# EAGLE design JonesHBridge (EAGLE 6.4)
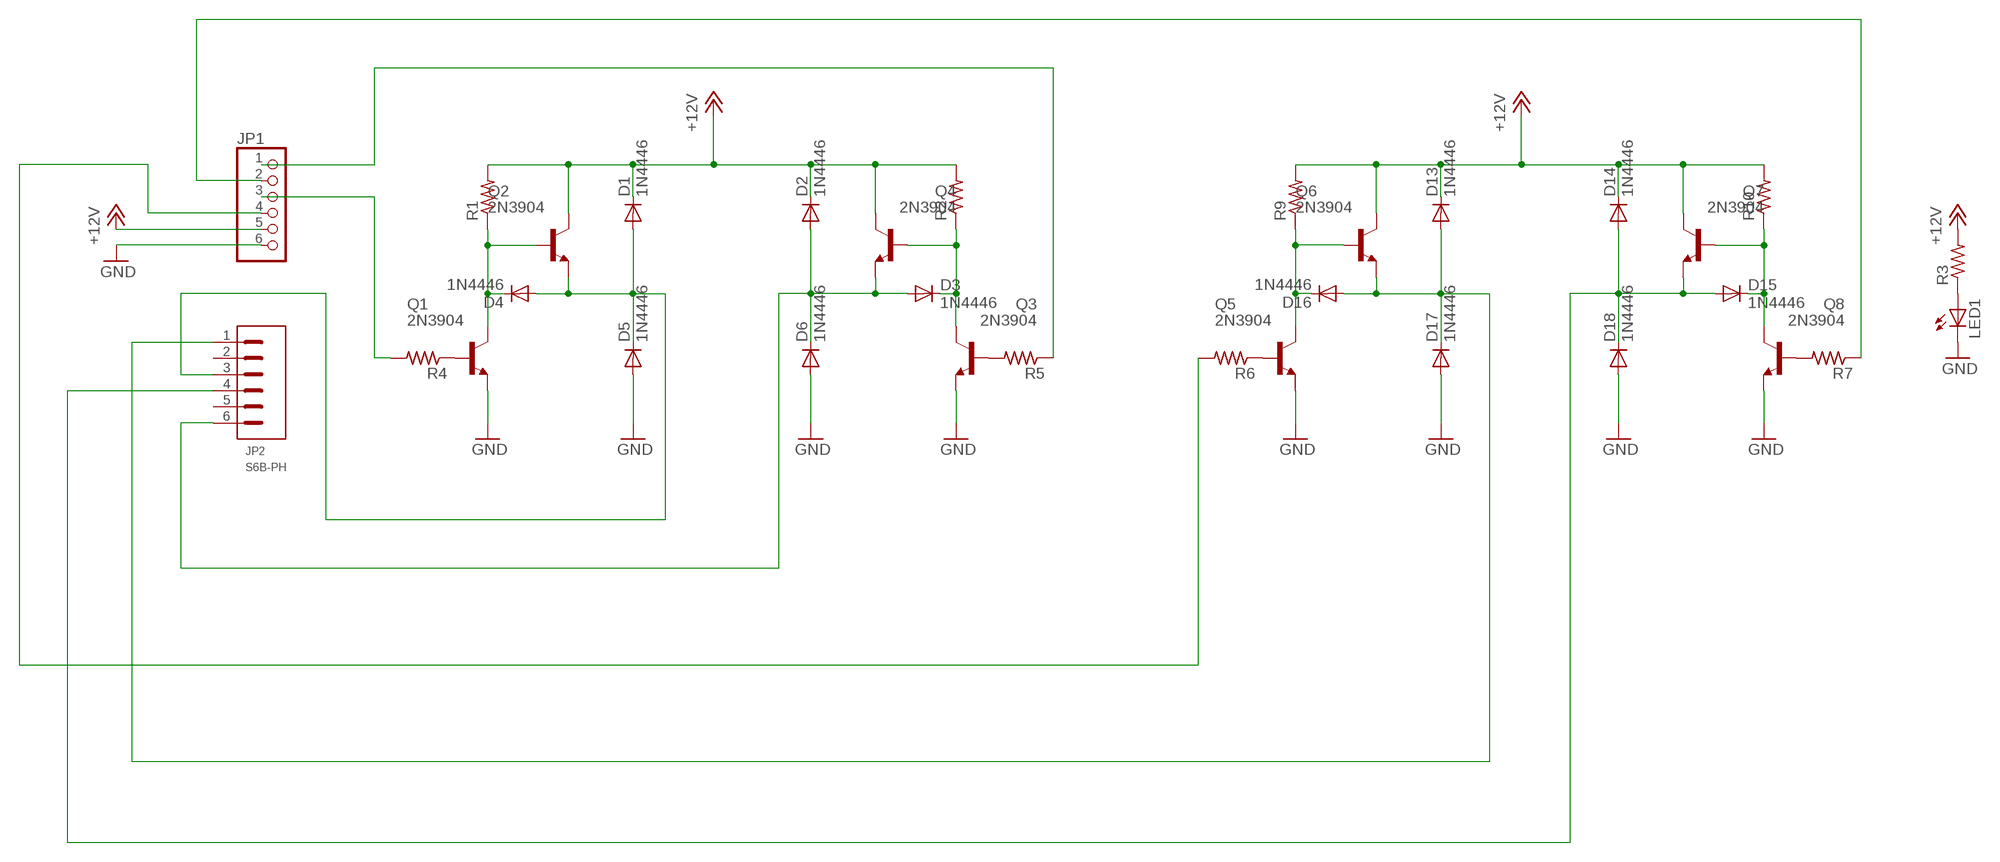
[diagram p0: schematic, sheet 1]

## Parts
D1  1N4446  [DO35-10]
D2  1N4446  [DO35-10]
D3  1N4446  [DO35-10]
D4  1N4446  [DO35-10]
D5  1N4446  [DO35-10]
D6  1N4446  [DO35-10]
D13  1N4446  [DO35-10]
D14  1N4446  [DO35-10]
D15  1N4446  [DO35-10]
D16  1N4446  [DO35-10]
D17  1N4446  [DO35-10]
D18  1N4446  [DO35-10]
JP1  PINHD-1X6  [1X06]
JP2  S6B-PH  [S6B]
LED1  LED3MM  [LED3MM]
Q1  2N3904  [TO92]
Q2  2N3904  [TO92]
Q3  2N3904  [TO92]
Q4  2N3904  [TO92]
Q5  2N3904  [TO92]
Q6  2N3904  [TO92]
Q7  2N3904  [TO92]
Q8  2N3904  [TO92]
R1  R-US_R0805  [R0805]
R2  R-US_R0805  [R0805]
R3  R-US_R0805  [R0805]
R4  R-US_R0805  [R0805]
R5  R-US_R0805  [R0805]
R6  R-US_R0805  [R0805]
R7  R-US_R0805  [R0805]
R9  R-US_R0805  [R0805]
R10  R-US_R0805  [R0805]

## Nets
+12V: D1.C D2.C D13.C D14.C JP1.5 Q2.1(C) Q4.1(C) Q6.1(C) Q7.1(C) R1.2 R2.2 R3.2 R9.2 R10.2
GND: D5.A D6.A D17.A D18.A JP1.6 LED1.K(C) Q1.3(E) Q3.3(E) Q5.3(E) Q8.3(E)
N$1: D4.C Q1.1(C) Q2.2(B) R1.1
N$2: D1.A D4.A D5.C JP2.3 Q2.3(E)
N$3: Q1.2(B) R4.1
N$4: LED1.A R3.1
N$5: Q5.2(B) R6.1
N$6: Q3.2(B) R5.2
N$7: D2.A D3.A D6.C JP2.6 Q4.3(E)
N$8: D3.C Q3.1(C) Q4.2(B) R2.1
N$9: Q8.2(B) R7.2
N$13: D16.C Q5.1(C) Q6.2(B) R9.1
N$14: D15.C Q7.2(B) Q8.1(C) R10.1
N$15: D14.A D15.A D18.C JP2.4 Q7.3(E)
N$16: D13.A D16.A D17.C JP2.1 Q6.3(E)
N$17: JP1.3 R4.2
N$18: JP1.1 R5.1
N$19: JP1.2 R7.1
N$20: JP1.4 R6.2
Unconnected: JP2.2 JP2.5

## Library data of the parts
D1-D6 D13-D18 = diode:1N4446: DIODE high speed (Philips)
JP1 = pinhead:PINHD-1X6: PIN HEADER
JP2 = !!dpkoch:S6B-PH
LED1 = led:LED: LED OSRAM: - CHIPLED LG R971, LG N971, LY N971, LG Q971, LY Q971, LO R971, LY R971 LH N974, LH R974 LS Q976, LO Q976, LY Q976 LO Q996 - Hyper CHIPLED LW Q18S LB Q993, LB Q99A, LB R99A - SideLED LS A670, LO A670, LY A670, LG A670, LP A670 LB A673, LV A673, LT A673, LW A673 LH A674 LY A675 LS A676, LA A676, LO A676, LY A676, LW A676 LS A679, LY A679, LG A679 - Hyper Micro SIDELED® LS Y876, LA Y876, LO Y876, LY Y876 LT Y87S - SmartLED LW L88C, LW L88S LB L89C, LB L89S, LG L890 LS L89K, LO L89K, LY L89K LS L896, LA L896, LO L896, LY L896 - TOPLED LS T670, LO T670, LY T670, LG T670, LP T670 LSG T670, LSP T670, LSY T670, LOP T670, LYG T670 LG T671, LOG T671, LSG T671 LB T673, LV T673, LT T673, LW T673 LH T674 LS T676, LA T676, LO T676, LY T676, LB T676, LH T676, LSB T676, LW T676 LB T67C, LV T67C, LT T67C, LS T67K, LO T67K, LY T67K, LW E67C LS E67B, LA E67B, LO E67B, LY E67B, LB E67C, LV E67C, LT E67C LW T67C LS T679, LY T679, LG T679 LS T770, LO T770, LY T770, LG T770, LP T770 LB T773, LV T773, LT T773, LW T773 LH T774 LS E675, LA E675, LY E675, LS T675 LS T776, LA T776, LO T776, LY T776, LB T776 LHGB T686 LT T68C, LB T68C - Hyper Mini TOPLED® LB M676 - Mini TOPLED Santana® LG M470 LS M47K, LO M47K, LY M47K Source: http://www.osram.convergy.de LUXEON: - LUMILED® LXK2-PW12-R00, LXK2-PW12-S00, LXK2-PW14-U00, LXK2-PW14-V00 LXK2-PM12-R00, LXK2-PM12-S00, LXK2-PM14-U00 LXK2-PE12-Q00, LXK2-PE12-R00, LXK2-PE12-S00, LXK2-PE14-T00, LXK2-PE14-U00 LXK2-PB12-K00, LXK2-PB12-L00, LXK2-PB12-M00, LXK2-PB14-N00, LXK2-PB14-P00, LXK2-PB14-Q00 LXK2-PR12-L00, LXK2-PR12-M00, LXK2-PR14-Q00, LXK2-PR14-R00 LXK2-PD12-Q00, LXK2-PD12-R00, LXK2-PD12-S00 LXK2-PH12-R00, LXK2-PH12-S00 LXK2-PL12-P00, LXK2-PL12-Q00, LXK2-PL12-R00 Source: www.luxeon.com KINGBRIGHT: KA-3528ASYC Source: www.kingbright.com
Q1-Q8 = transistor-npn:2N3904: NPN Transistor
R1-R7 R9 R10 = resistor:R-US_: RESISTOR, American symbol

## Board
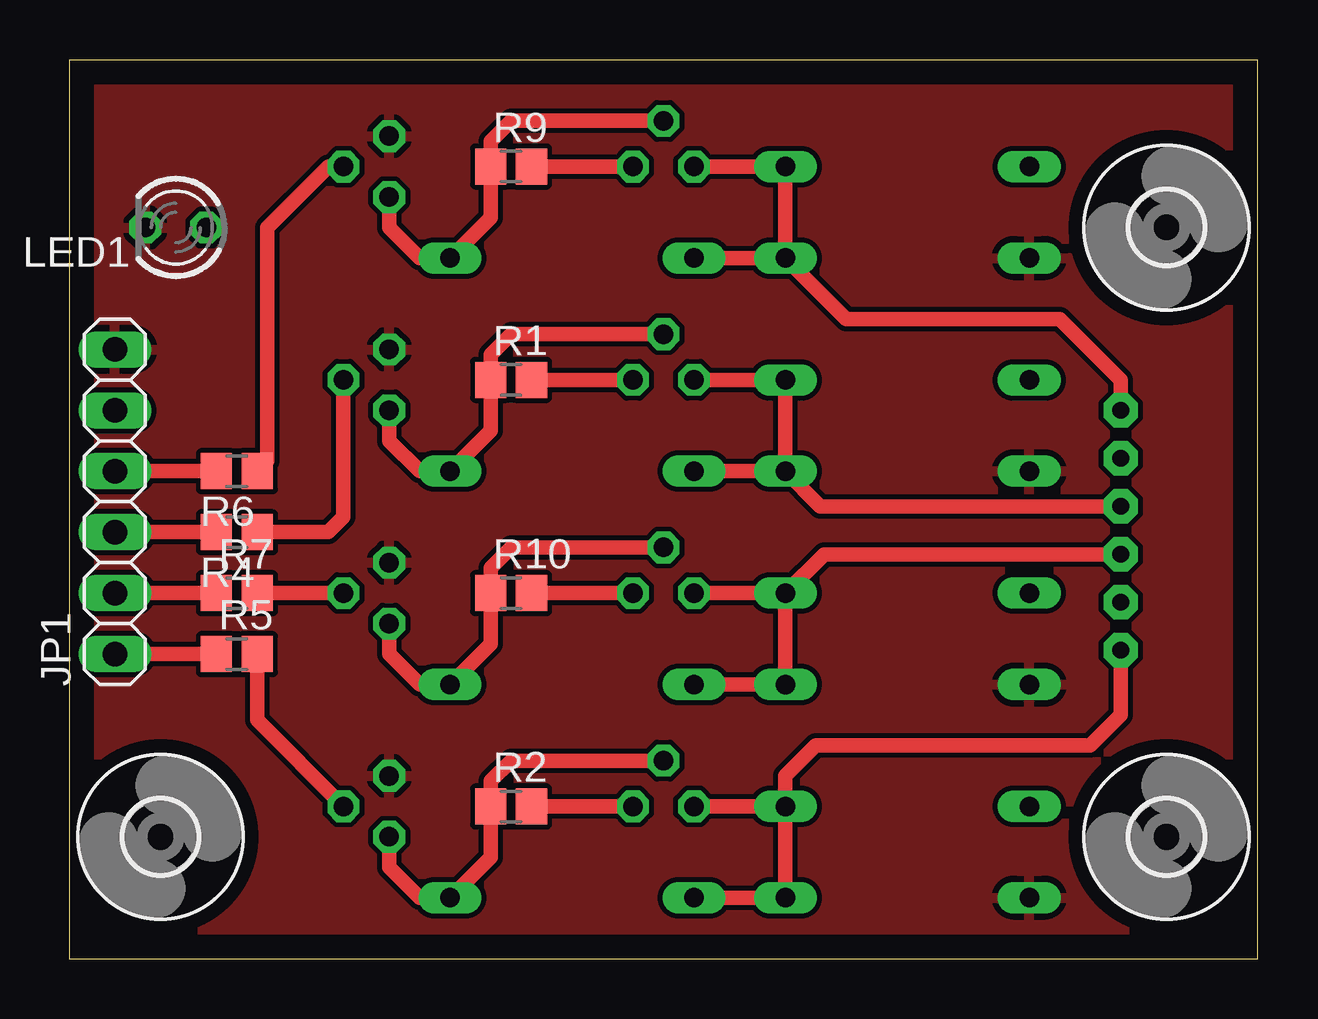
[diagram p1: board, top side]
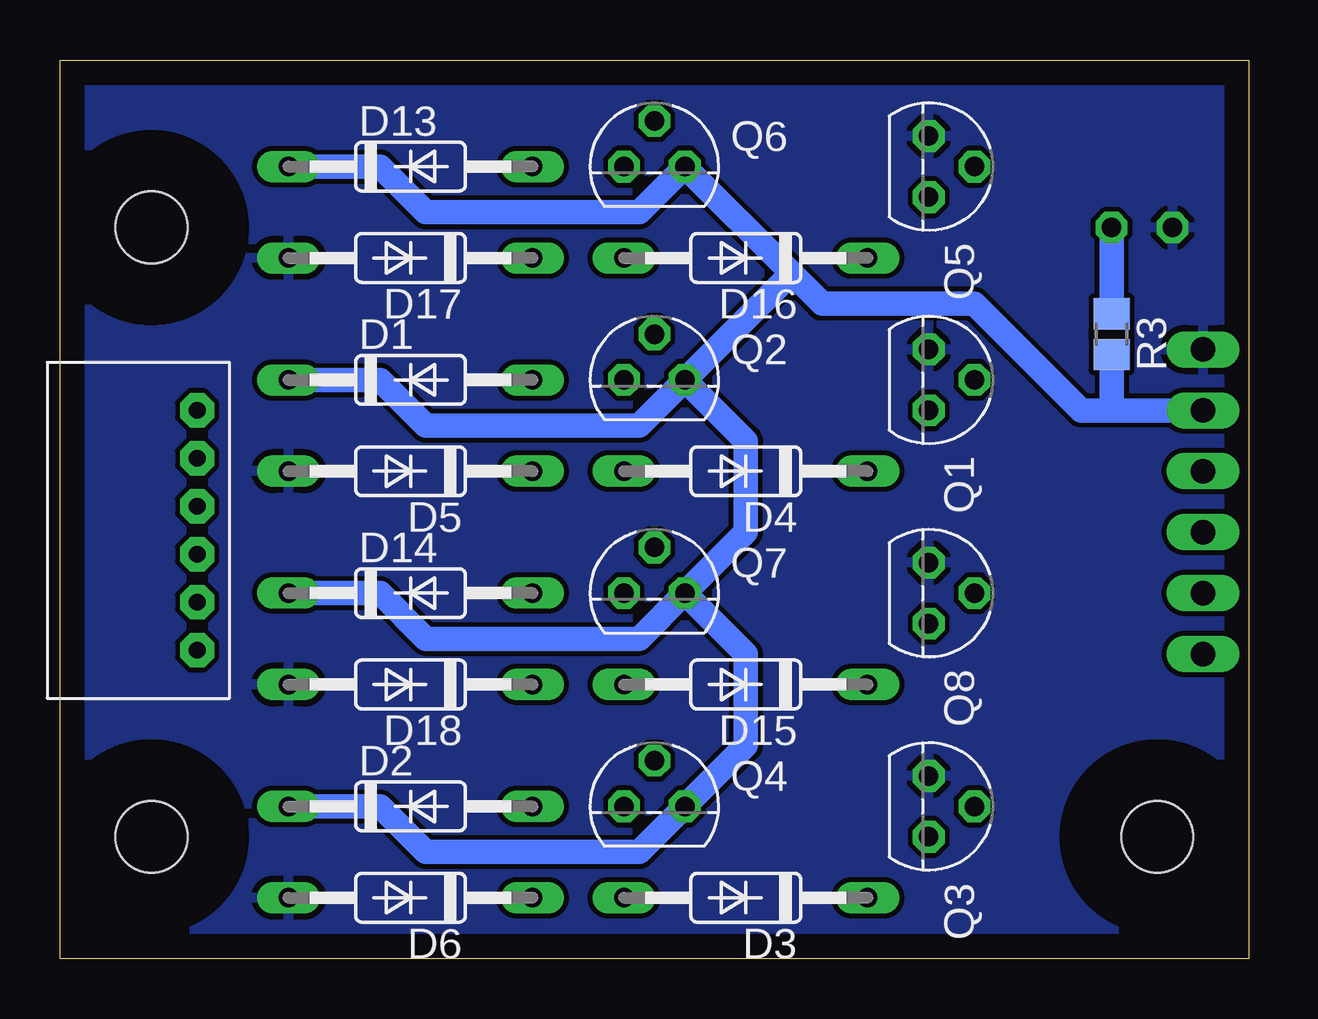
[diagram p2: board, bottom side, seen from below]

Size 49.53 x 37.47 mm. Coordinates in mm from the lower left corner, seen from the top.
Outline: 0,0 49.53,0 49.53,37.47 0,37.47 0,0
Copper layers (1*16): Top 0.035mm / dielectric 1.5mm / Bottom 0.035mm
Design rules "default": minimum track width 10mil, minimum drill 24mil, track to track 8mil, track to pad 8mil, pad to pad 8mil, via to via 8mil, smd to smd 8mil, copper to edge 40mil, drill to drill 8mil, minimum pad ring 10mil, minimum via ring 8mil, stop-mask expansion 4mil, vias tented up to drill 0mil, thermal gap 10mil

### Footprints (pad centres in the part's own frame; a part is rotated, then mirrored left to right if it is on the bottom)
DO35-10 = drill 0.813 long: A 5.08,0; C -5.08,0
1X06 = drill 1.016 long: 1 -6.35,0; 2 -3.81,0; 3 -1.27,0; 4 1.27,0; 5 3.81,0; 6 6.35,0
S6B = drill 0.7 pad 1.422 octagon: 1 0,0; 2 2,0; 3 4,0; 4 6,0; 5 8,0; 6 10,0
LED3MM = drill 0.813 octagon: A -1.27,0; K 1.27,0
TO92 = drill 0.813 octagon: 1 1.27,0; 2 0,1.905; 3 -1.27,0
R0805 = smd 1.3 x 1.5: 1 -0.85,0; 2 0.85,0
3,0 = hole 3: 0,0

### Placement (x,y rotation side)
D1  34.92,24.13 0 bottom
D2  34.92,6.35 0 bottom
D3  20.96,2.54 180 bottom
D4  20.96,20.32 180 bottom
D5  34.92,20.32 180 bottom
D6  34.92,2.54 180 bottom
D13  34.92,33.02 0 bottom
D14  34.92,15.24 0 bottom
D15  20.96,11.43 180 bottom
D16  20.96,29.21 180 bottom
D17  34.92,29.21 180 bottom
D18  34.92,11.43 180 bottom
JP1  1.9,19.05 90 top
JP2  43.81,22.86 270 bottom
LED1  4.45,30.48 180 top
Q1  13.34,24.13 270 bottom
Q2  24.77,24.13 0 bottom
Q3  13.34,6.35 270 bottom
Q4  24.77,6.35 0 bottom
Q5  13.34,33.02 270 bottom
Q6  24.77,33.02 0 bottom
Q7  24.77,15.24 0 bottom
Q8  13.34,15.24 270 bottom
R1  18.41,24.13 0 top
R2  18.41,6.35 0 top
R3  5.71,26.04 270 bottom
R4  6.99,17.78 180 top
R5  6.99,12.7 0 top
R6  6.99,20.32 180 top
R7  6.99,15.24 0 top
R9  18.41,33.02 0 top
R10  18.41,15.24 0 top
U$1  [3,0]  3.81,5.08 0 top
U$2  [3,0]  45.72,5.08 0 top
U$3  [3,0]  45.72,30.48 0 top

### Tracks (layer width: path | path; a pad name or v marks a point on that pad's centre or on a via)
+12V
  Top 0.61: R2.2 Q4.1 | R10.2 Q7.1 | R1.2 Q2.1 | Q6.1 R9.2
  Bottom 1.016: 19.05,28.57 17.78,27.3 11.43,27.3 6.99,22.86 5.71,22.86 | 19.05,28.57 Q6.1 25.4,31.11 34.29,31.11 36.2,33.02 D13.C | Q2.1 19.05,28.57 | Q7.1 20.96,17.78 20.96,21.59 Q2.1 | Q7.1 20.96,12.7 20.96,8.89 Q4.1 25.4,4.45 34.29,4.45 36.2,6.35 D2.C | D14.C 36.2,15.24 34.29,13.34 25.4,13.34 Q7.1 | D1.C 36.2,24.13 34.29,22.23 25.4,22.23 Q2.1 | JP1.5 5.71,22.86 | R3.2 5.71,22.86
GND
  pour Top: -2.54,157.48 -3.81,157.48 -3.81,-5.08 220.98,-5.08 220.98,157.48
  pour Bottom: -2.54,157.48 -6.35,157.48 -6.35,-7.62 231.14,-7.62 231.14,157.48
N$1
  Top 0.61: Q2.2 18.41,26.04 17.57,25.18 R1.1 17.57,22.01 D4.C 14.61,20.32 13.34,21.59 Q1.1
N$2
  Top 0.61: Q2.3 D1.A D5.C | D5.C D4.A | JP2.3 31.31,18.86 D5.C
N$3
  Top 0.61: Q1.2 11.43,18.41 10.79,17.78 R4.1
N$4
  Bottom 1.016: R3.1 LED1.A
N$5
  Top 0.61: Q5.2 10.79,33.02 8.26,30.48 8.26,20.74 R6.1
N$6
  Top 0.61: R5.2 7.84,9.95 Q3.2
N$7
  Top 0.61: Q4.3 D2.A | D2.A D6.C D3.A | D2.A 29.84,7.62 31.11,8.89 42.54,8.89 43.81,10.16 JP2.6
N$8
  Top 0.61: Q4.2 18.41,8.26 17.57,7.41 R2.1 17.57,4.23 D3.C 14.61,2.54 13.34,3.81 Q3.1
N$9
  Top 0.61: Q8.2 R7.2
N$13
  Top 0.61: Q6.2 18.41,34.92 17.57,34.08 R9.1 17.57,30.9 D16.C 14.61,29.21 13.34,30.48 Q5.1
N$14
  Top 0.61: Q7.2 18.41,17.14 17.57,16.3 R10.1 17.57,13.12 D15.C 14.61,11.43 13.34,12.7 Q8.1
N$15
  Top 0.61: D15.A D18.C D14.A | D14.A Q7.3 | JP2.4 31.46,16.86 D14.A
N$16
  Top 0.61: Q6.3 D13.A D17.C | D17.C D16.A | JP2.1 43.81,24.13 41.27,26.67 32.38,26.67 D17.C
N$17
  Top 0.61: JP1.3 R4.2
N$18
  Top 0.61: JP1.1 R5.1
N$19
  Top 0.61: JP1.2 R7.1
N$20
  Top 0.61: JP1.4 R6.2